# Altium schematic sheet Acoustics Board.SchDoc
size A
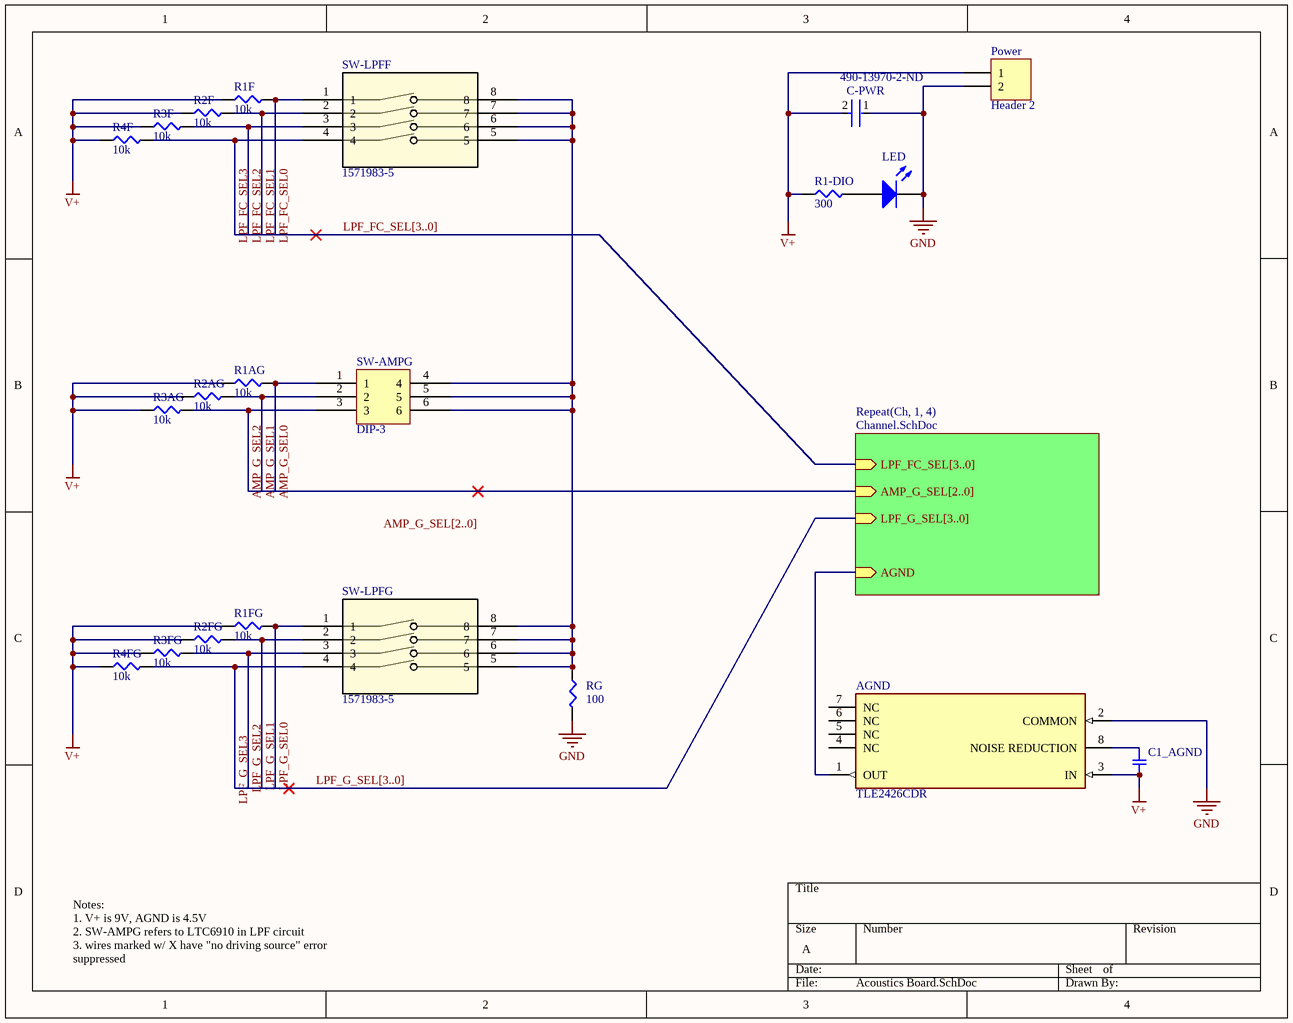
[diagram p0: Acoustics Board.SchDoc]

## Parts
AGND  TLE2426CDR  [FP-D0008A-IPC_B]
C1_AGND  1µF  [SMD-0805C]  (value not drawn)
C-PWR  Supplier Part Number 1: 490-13970-2-ND  [FP-GRM31C-0_3-e0_3_0_9-IPC_C]  (hidden comment: GRM31CR60J227ME11L)
LED  150080SS75000  [0805_A]  (value not drawn)
Power  Header 2  [HDR1X2]
R1-DIO  300  [SMD-0805-RES]
R1AG  10k  [SMD-0805-RES]
R1F  10k  [SMD-0805-RES]
R1FG  10k  [SMD-0805-RES]
R2AG  10k  [SMD-0805-RES]
R2F  10k  [SMD-0805-RES]
R2FG  10k  [SMD-0805-RES]
R3AG  10k  [SMD-0805-RES]
R3F  10k  [SMD-0805-RES]
R3FG  10k  [SMD-0805-RES]
R4F  10k  [SMD-0805-RES]
R4FG  10k  [SMD-0805-RES]
RG  100  [SMD-0805-RES]
SW-AMPG  DIP-3  [DIP6]
SW-LPFF  1571983-5  [SW4_1571983_4P_TEC]
SW-LPFG  1571983-5  [SW4_1571983_4P_TEC]

## Sub-sheets
Repeat(Ch, 1, 4) = Channel.SchDoc: LPF_FC_SEL[3..0] (in), AMP_G_SEL[2..0] (in), LPF_G_SEL[3..0] (in), AGND (in)

## Nets
GND: AGND.2(COMMON) C-PWR.1 LED.1(K) Power.2 RG.2
V+: AGND.3(IN) C1_AGND.2 C-PWR.2 Power.1 R1-DIO.1 R1AG.1 R1F.1 R1FG.1 R2AG.1 R2F.1 R2FG.1 R3AG.1 R3F.1 R3FG.1 R4F.1 R4FG.1
AMP_G_SEL0: R1AG.2 SW-AMPG.1
AMP_G_SEL1: R2AG.2 SW-AMPG.2
AMP_G_SEL2: R3AG.2 SW-AMPG.3
LPF_FC_SEL0: R1F.2 SW-LPFF.1
LPF_FC_SEL1: R2F.2 SW-LPFF.2
LPF_FC_SEL2: R3F.2 SW-LPFF.3
LPF_FC_SEL3: R4F.2 SW-LPFF.4
LPF_G_SEL0: R1FG.2 SW-LPFG.1
LPF_G_SEL1: R2FG.2 SW-LPFG.2
LPF_G_SEL2: R3FG.2 SW-LPFG.3
LPF_G_SEL3: R4FG.2 SW-LPFG.4
NetAGND_1: AGND.1(OUT) ; sheet Repeat(Ch, 1, 4)/AGND
NetAGND_8: AGND.8(NOISE_REDUCTION) C1_AGND.1
NetLED_2: LED.2(A) R1-DIO.2
NetRG_1: RG.1 SW-AMPG.4 SW-AMPG.5 SW-AMPG.6 SW-LPFF.5 SW-LPFF.6 SW-LPFF.7 SW-LPFF.8 SW-LPFG.5 SW-LPFG.6 SW-LPFG.7 SW-LPFG.8

Not connected (* = marked no-connect by the designer): AGND 4(NC) 5(NC) 6(NC) 7(NC)

## Buses and harness runs
bus AMP_G_SEL[2..0]
bus LPF_FC_SEL[3..0] = sheet Repeat(Ch, 1, 4)/LPF_FC_SEL[3..0]
bus LPF_G_SEL[3..0] = sheet Repeat(Ch, 1, 4)/LPF_G_SEL[3..0]

## Notes on the sheet
- Notes:
  1. V+ is 9V, AGND is 4.5V
  2. SW-AMPG refers to LTC6910 in LPF circuit
  3. wires marked w/ X have "no driving source" error suppressed
- Labels drawn without touching a wire or pin: AMP_G_SEL[2..0]

## Library data of the parts
AGND = CMP-04916-000011-1: Ground Reference (Virtual) Voltage Reference IC Adjustable 2V 20 VV ±1% 20 mA 8-SOIC; Manufacturer: Texas Instruments; Manufacturer Part Number: TLE2426MD; Value: N/A; Operating Temperature: -55°C ~ 125°C; Datasheet Link: https://www.digikey.com/en/products/detail/texas-instruments/TLE2426MD/1676989; Package / Case: 8-SOIC; Descriptions: Ground Reference (Virtual) Voltage Reference IC Adjustable 2V 20 VV ±1% 20 mA 8-SOIC
C1_AGND = GCJ219R71C105KA01D: Manufacturer: KEMET; Manufacturer Part Number: C0805C105K3RAC7800; Descriptions: 1 µF ±10% 25V Ceramic Capacitor X7R 0805 (2012 Metric); Datasheet Link: https://api.kemet.com/component-edge/download/datasheet/C0805C105K3RACTU.pdf; Value: 1µF; Operating Temperature: -55°C ~ 125°C; Package / Case: 0805 (2012 Metric)
C-PWR = CMP-06035-000079-2: Chip Multilayer Ceramic Capacitors for General Purpose, 1206, 220uF, X5R, 15%, 20%, 6.3V; Manufacturer: Murata; Mount: Surface Mount; Width: 0.063inch; Voltage Rating: 6.3V; Packaging: Cut Tape; Dielectric: X5R; Capacitance: 220uF; Voltage Rating (DC): 6.3V; Case/Package: 1206; Thickness: 0.075inch; Tolerance: 20%; Max Operating Temperature: 85°C; Case Code (Metric): 3216; Min Operating Temperature: -55°C; Length: 0.126inch; REACH SVHC: No SVHC; Case Code (Imperial): 1206; Supplier 1: Digi-Key; Manufacturer Part Number: GRM31CR60J227ME11L; RoHS: Yes; Category: Ceramic Capacitors; Stock 1: 266877; Pricing 1: 2000=0.46209, 4000=0.44559, 10000=0.42909, 14000=0.42083 (USD); RoHS Compliant: Yes; ComponentLink1URL: http://www.farnell.com/datasheets/2867879.pdf?src-supplier=Farnell; ComponentLink1Description: http://www.farnell.com/datasheets/2867879.pdf?src-supplier=Farnell; ComponentLink2URL: http://search.murata.co.jp/Ceramy/image/img/A01X/partnumbering_e_01.pdf?src-supplier=Digi-Key; ComponentLink2Description: http://search.murata.co.jp/Ceramy/image/img/A01X/partnumbering_e_01.pdf?src-supplier=Digi-Key; ComponentLink3URL: http://search.murata.co.jp/Ceramy/image/img/A01X/G101/ENG/GRM31CR60J227ME11-01.pdf?src-supplier=Digi-Key; ComponentLink3Description: http://search.murata.co.jp/Ceramy/image/img/A01X/G101/ENG/GRM31CR60J227ME11-01.pdf?src-supplier=Digi-Key; ComponentLink4URL: http://www.farnell.com/datasheets/2867879.pdf?src-supplier=Element14; ComponentLink4Description: http://www.farnell.com/datasheets/2867879.pdf?src-supplier=Element14; ComponentLink5URL: http://www.farnell.com/datasheets/1957826.pdf?src-supplier=Newark; ComponentLink5Description: http://www.farnell.com/datasheets/1957826.pdf?src-supplier=Newark
LED = CMP-1426-00010-1: Red 630nm LED Indication - Discrete 1.9V 0805 (2012 Metric); Manufacturer: Wuerth Elektronik; Value: 1.9V; Operating Temperature: -40°C ~ 85°C; Manufacturer Part Number: 150080SS75000; Datasheet Link: https://www.we-online.com/katalog/datasheet/150080SS75000.pdf; Package / Case: 0805 (2012 Metric); Descriptions: Red 630nm LED Indication - Discrete 1.9V 0805 (2012 Metric)
R1-DIO = ERJ-6ENF1002V: Manufacturer: Stackpole Electronics Inc; Manufacturer Part Number: RNCF0805DTE300R; Descriptions: 300 Ohms ±0.5% 0.125W, 1/8W Chip Resistor 0805 (2012 Metric) Automotive AEC-Q200 Thin Film; Datasheet Link: https://www.seielect.com/catalog/sei-rncf.pdf; Value: 300; Operating Temperature: -55°C ~ 155°C; Package / Case: 0805 (2012 Metric)
R1AG R1F R1FG R2AG R2F R2FG R3AG R3F R3FG R4F R4FG = ERJ-6ENF1002V: Manufacturer: Panasonic Electronic Components; Manufacturer Part Number: RMCF0805JG10K0; Descriptions: 10 kOhms ±5% 0.125W, 1/8W Chip Resistor 0805 (2012 Metric) Automotive AEC-Q200 Thick Film; Datasheet Link: https://www.seielect.com/catalog/sei-rmcf_rmcp.pdf; Value: 10k; Operating Temperature: -55°C ~ 155°C; Package / Case: 0805 (2012 Metric)
RG = ERJ-P06F1000V: RES SMD 100 OHM 1% 1/2W 0805; Manufacturer: Panasonic Electronic Components; Factory Stock: 0; Unit Price (USD): 0.02534; @ qty: 1500; Minimum Quantity: 1; Power (Watts): 0.5W, 1/2W; Temperature Coefficient: ±100ppm/°C; Part Number: ERJ-P06F1000V; Datasheets: https://industrial.panasonic.com/cdbs/www-data/pdf/RDA0000/AOA0000C243.pdf; Image: //media.digikey.com/Renders/Panasonic%20Renders/ERJ-0805%20Pkg.jpg; Digi-Key Part Number: P16057CT-ND; Quantity Available: 28131; Packaging: Cut Tape (CT); Series: ERJ; Part Status: Active; Value: 100; Tolerance: ±1%; Composition: Thick Film; Features: Automotive AEC-Q200, Pulse Withstanding; Operating Temperature: -55°C ~ 155°C; Package / Case: 0805 (2012 Metric); Supplier Device Package: 0805; Size / Dimension: 0.079" L x 0.049" W (2.00mm x 1.25mm); Height - Seated (Max): 0.028" (0.70mm); Number of Terminations: 2; Failure Rate: -
SW-LPFF SW-LPFG = 1571983-5: No Description Available; Mfr_Name: TE Connectivity; Copyright: Copyright (C) 2022 Ultra Librarian. All rights reserved.; Manufacturer_Part_Number: 1571983-5; Digi-Key_Part_Number_1: 450-1762-1-ND; Digi-Key_Part_Number_2: 450-1762-2-ND; Digi-Key_Part_Number_3: 450-1762-6-ND; RefDes: RefDes; Type: DEV
Power = Header 2: Value: N/A; Package / Case: HDR1X2